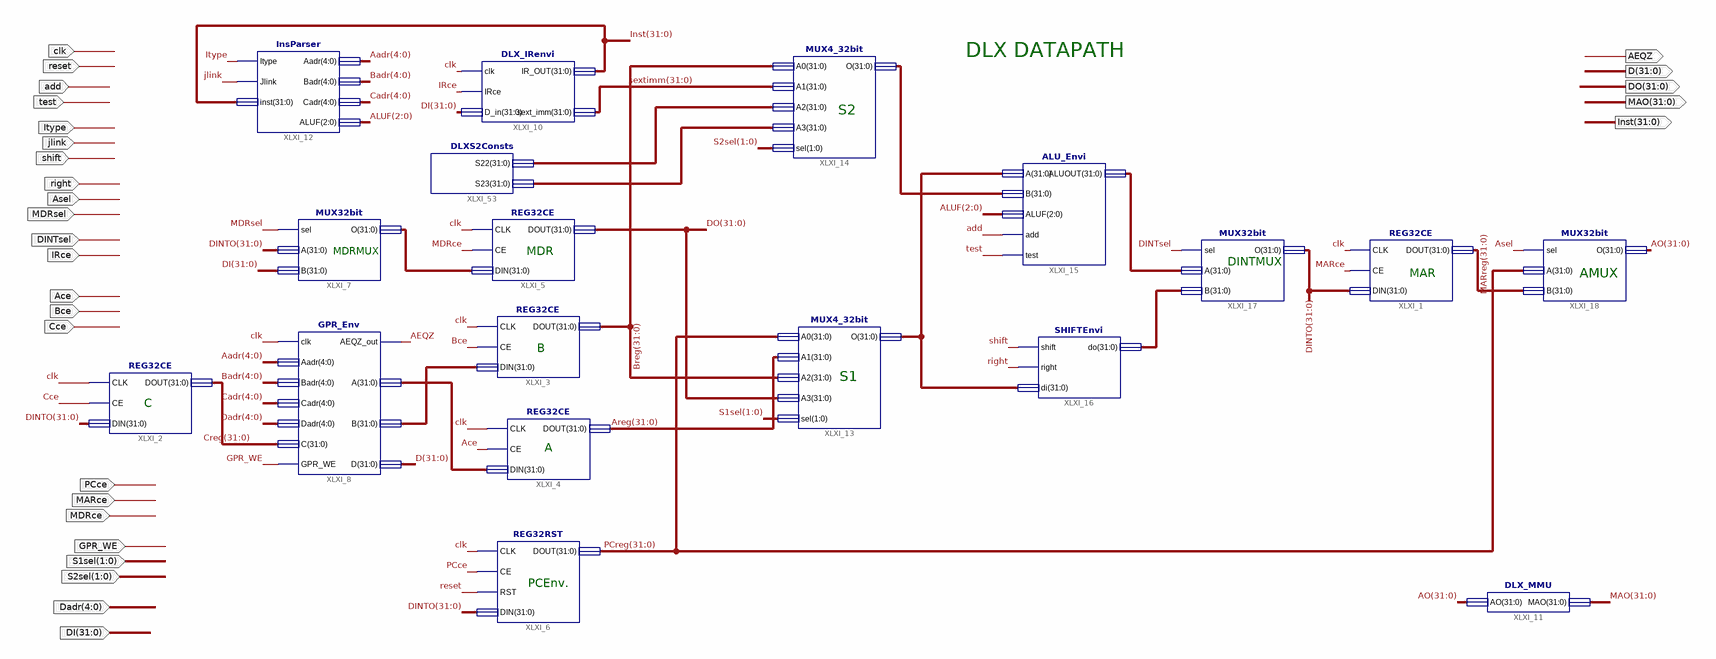
[diagram p0: schematic sheet 1]
// Xilinx ISE schematic DLXDataPath.sch (spartan6) as structural Verilog: 18 symbols, 28 ports
module DLXDataPath (
  input  clk,
  input  PCce,
  input  MARce,
  input  MDRce,
  input  GPR_WE,
  input  [1:0] S1sel,
  input  [1:0] S2sel,
  input  add,
  input  test,
  input  Itype,
  input  jlink,
  input  shift,
  input  right,
  input  Asel,
  input  MDRsel,
  input  DINTsel,
  input  IRce,
  input  Ace,
  input  Bce,
  input  Cce,
  input  reset,
  input  [4:0] Dadr,
  input  [31:0] DI,
  output [31:0] DO,
  output [31:0] D,
  output AEQZ,
  output [31:0] MAO,
  output [31:0] Inst
);

  wire [2:0] ALUF;
  wire [4:0] Aadr, Badr, Cadr;
  wire [31:0] AO, Areg, Breg, Creg, DINTO, MARreg, PCreg, sextimm, XLXN_51, XLXN_52, XLXN_53, XLXN_63,
       XLXN_64, XLXN_93, XLXN_98, XLXN_99, XLXN_100;

  REG32CE XLXI_2 (.CLK(clk), .CE(Cce), .DIN(DINTO), .DOUT(Creg));
  REG32CE XLXI_3 (.CLK(clk), .CE(Bce), .DIN(XLXN_51), .DOUT(Breg));
  REG32CE XLXI_4 (.CLK(clk), .CE(Ace), .DIN(XLXN_52), .DOUT(Areg));
  REG32CE XLXI_5 (.CLK(clk), .CE(MDRce), .DIN(XLXN_53), .DOUT(DO));
  REG32RST XLXI_6 (.CLK(clk), .CE(PCce), .RST(reset), .DIN(DINTO), .DOUT(PCreg));
  MUX32bit XLXI_7 (.sel(MDRsel), .A(DINTO), .B(DI), .O(XLXN_53));
  GPR_Env XLXI_8 (
    .clk(clk), .Aadr(Aadr), .Badr(Badr), .Cadr(Cadr), .Dadr(Dadr), .C(Creg), .GPR_WE(GPR_WE),
    .AEQZ_out(AEQZ), .A(XLXN_52), .B(XLXN_51), .D(D));
  DLX_IRenvi XLXI_10 (.clk(clk), .IRce(IRce), .D_in(DI), .IR_OUT(Inst), .sext_imm(sextimm));
  DLXS2Consts XLXI_53 (.S22(XLXN_63), .S23(XLXN_64));
  REG32CE XLXI_1 (.CLK(clk), .CE(MARce), .DIN(DINTO), .DOUT(MARreg));
  DLX_MMU XLXI_11 (.AO(AO), .MAO(MAO));
  MUX32bit XLXI_18 (.sel(Asel), .A(PCreg), .B(MARreg), .O(AO));
  MUX4_32bit XLXI_14 (.A0(Breg), .A1(sextimm), .A2(XLXN_63), .A3(XLXN_64), .sel(S2sel), .O(XLXN_93));
  MUX4_32bit XLXI_13 (.A0(PCreg), .A1(Areg), .A2(Breg), .A3(DO), .sel(S1sel), .O(XLXN_98));
  ALU_Envi XLXI_15 (.A(XLXN_98), .B(XLXN_93), .ALUF(ALUF), .add(add), .test(test), .ALUOUT(XLXN_99));
  SHIFTEnvi XLXI_16 (.shift(shift), .right(right), .di(XLXN_98), .\do (XLXN_100));
  MUX32bit XLXI_17 (.sel(DINTsel), .A(XLXN_99), .B(XLXN_100), .O(DINTO));
  InsParser XLXI_12 (.Itype(Itype), .Jlink(jlink), .inst(Inst), .Aadr(Aadr), .Badr(Badr), .Cadr(Cadr), .ALUF(ALUF));

  // Notes on the sheet:
  //   DLX DATAPATH
  //   S2
  //   MDRMUX
  //   MDR
  //   DINTMUX
  //   MAR
  //   AMUX
  //   B
  //   S1
  //   C
  //   A
  //   PCEnv.
endmodule
